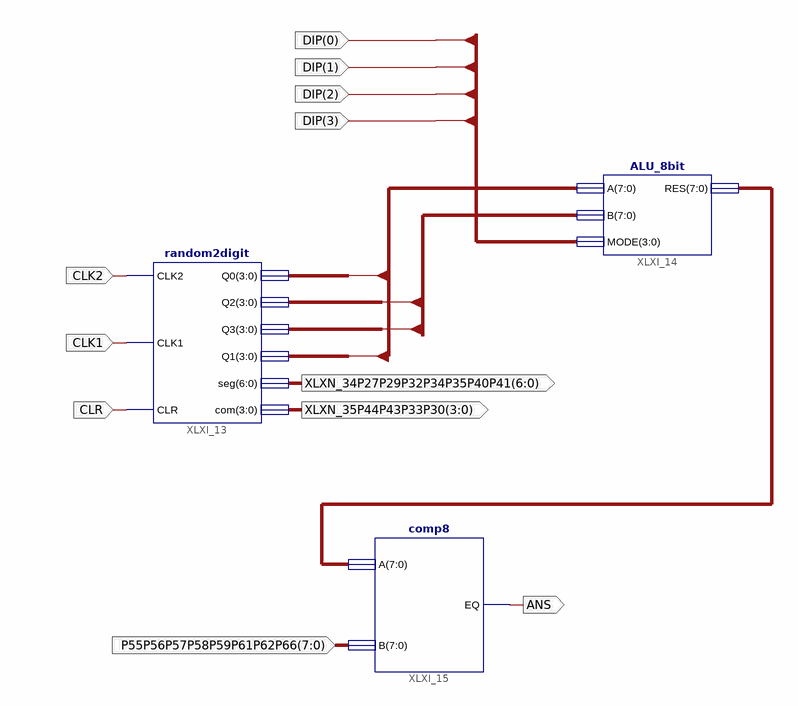
[diagram p0: schematic sheet 1]
// Xilinx ISE schematic main.sch (spartan6) as structural Verilog: 3 symbols, 11 ports
module main (
  input  CLR,
  input  CLK1,
  input  CLK2,
  input  [3:0] DIP,
  input  [7:0] P55P56P57P58P59P61P62P66,
  output [6:0] XLXN_34P27P29P32P34P35P40P41,
  output [3:0] XLXN_35P44P43P33P30,
  output ANS
);

  wire [7:0] A, B, XLXN_42;

  random2digit XLXI_13 (
    .CLK2(CLK2), .CLK1(CLK1), .CLR(CLR), .Q0(A[3:0]), .Q2(B[3:0]), .Q3(B[7:4]), .Q1(A[7:4]),
    .seg(XLXN_34P27P29P32P34P35P40P41), .com(XLXN_35P44P43P33P30));
  ALU_8bit XLXI_14 (.A(A), .B(B), .MODE(DIP), .RES(XLXN_42));
  comp8 XLXI_15 (.A(XLXN_42), .B(P55P56P57P58P59P61P62P66), .EQ(ANS));

  // Notes on the sheet:
  //   LOC on signal DIP(0) = P112
  //   LOC on signal DIP(1) = P111
  //   LOC on signal DIP(2) = P105
  //   LOC on signal DIP(3) = P104
endmodule
